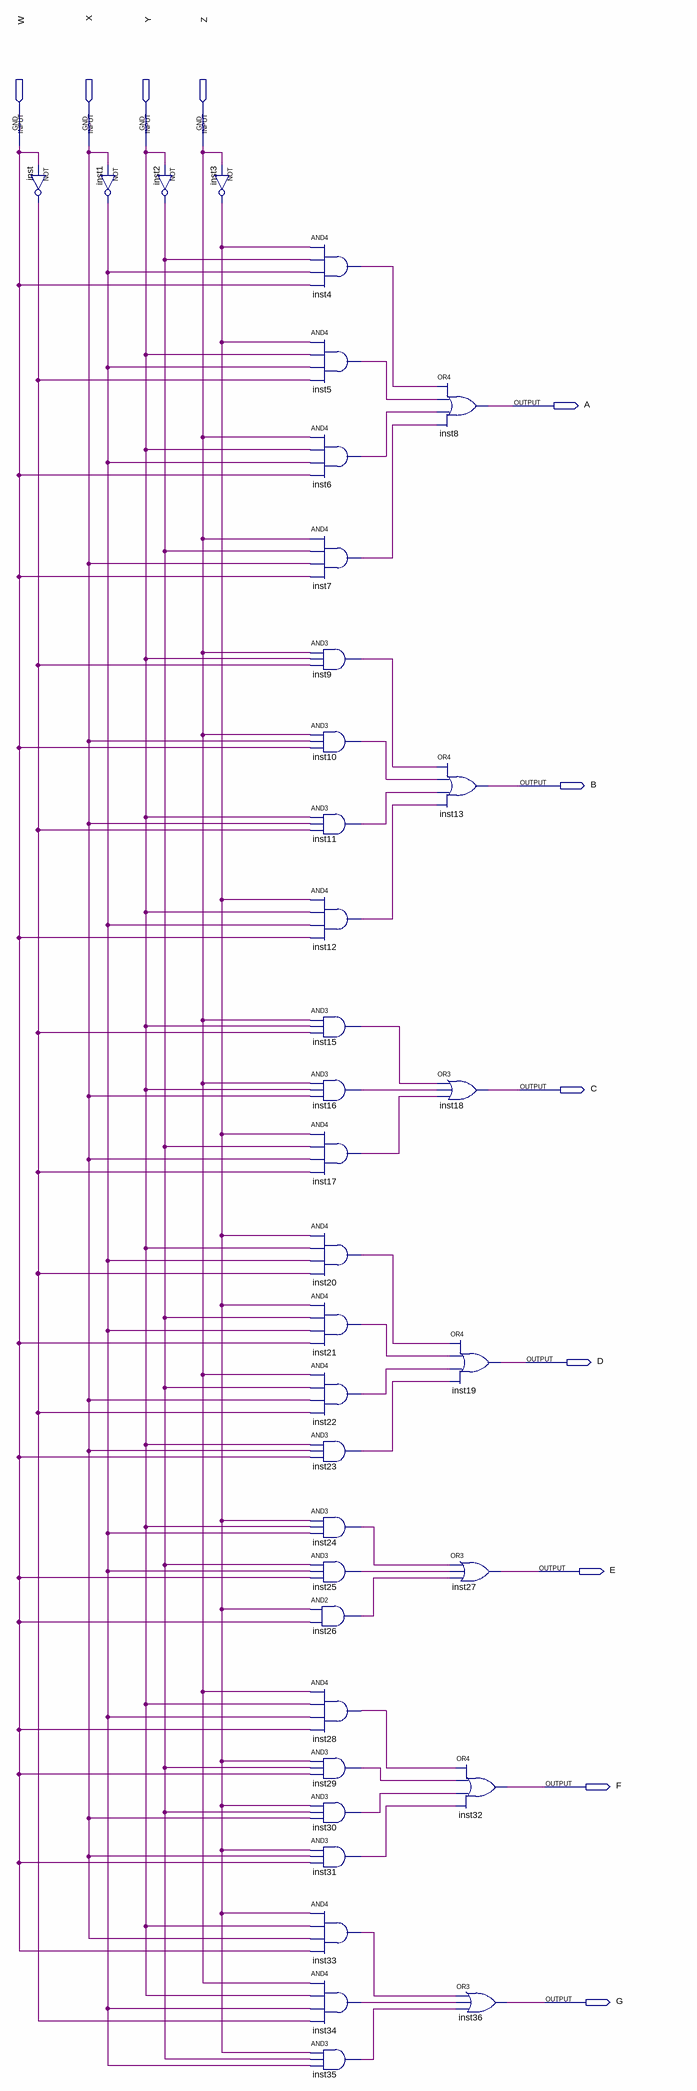
[diagram p0: schematic sheet]
// Quartus schematic displayDecode.bdf as structural Verilog: 36 symbols, 11 pins
module displayDecode (
  input  W,
  input  X,
  input  Y,
  input  Z,
  output A,
  output B,
  output C,
  output D,
  output E,
  output F,
  output G
);

  wire inst1_out, inst2_out, inst3_out, inst4_out, inst5_out, inst6_out, inst7_out, inst9_out, inst10_out,
       inst11_out, inst12_out, inst15_out, inst16_out, inst17_out, inst20_out, inst21_out, inst22_out,
       inst23_out, inst24_out, inst25_out, inst26_out, inst28_out, inst29_out, inst30_out, inst31_out,
       inst33_out, inst34_out, inst35_out, inst_out;

  not inst (inst_out, W);
  not inst1 (inst1_out, X);
  not inst2 (inst2_out, Y);
  not inst3 (inst3_out, Z);
  and inst4 (inst4_out, inst3_out, inst2_out, inst1_out, W);
  and inst5 (inst5_out, inst3_out, Y, inst1_out, inst_out);
  and inst6 (inst6_out, Z, Y, inst1_out, W);
  and inst7 (inst7_out, Z, inst2_out, X, W);
  and inst9 (inst9_out, Z, Y, inst_out);
  and inst10 (inst10_out, Z, X, W);
  and inst11 (inst11_out, Y, X, inst_out);
  and inst12 (inst12_out, inst3_out, Y, inst1_out, W);
  and inst15 (inst15_out, Z, Y, inst_out);
  and inst16 (inst16_out, Z, Y, X);
  and inst17 (inst17_out, inst3_out, inst2_out, X, inst_out);
  and inst20 (inst20_out, inst3_out, Y, inst1_out, inst_out);
  and inst21 (inst21_out, inst3_out, inst2_out, inst1_out, W);
  and inst22 (inst22_out, Z, inst2_out, X, inst_out);
  and inst23 (inst23_out, Y, X, W);
  and inst24 (inst24_out, inst3_out, Y, inst1_out);
  and inst25 (inst25_out, inst2_out, inst1_out, W);
  and inst26 (inst26_out, inst3_out, W);
  and inst28 (inst28_out, Z, Y, inst1_out, W);
  and inst29 (inst29_out, inst3_out, inst2_out, W);
  and inst30 (inst30_out, inst3_out, inst2_out, X);
  and inst31 (inst31_out, inst3_out, X, W);
  and inst33 (inst33_out, inst3_out, Y, X, W);
  and inst34 (inst34_out, Z, Y, inst1_out, inst_out);
  and inst35 (inst35_out, inst3_out, inst2_out, inst1_out);
  or inst8 (A, inst4_out, inst5_out, inst6_out, inst7_out);
  or inst13 (B, inst9_out, inst10_out, inst11_out, inst12_out);
  or inst18 (C, inst15_out, inst16_out, inst17_out);
  or inst19 (D, inst20_out, inst21_out, inst22_out, inst23_out);
  or inst27 (E, inst24_out, inst25_out, inst26_out);
  or inst32 (F, inst28_out, inst29_out, inst30_out, inst31_out);
  or inst36 (G, inst33_out, inst34_out, inst35_out);
endmodule
